# EAGLE schematic iot (EAGLE 6.5.0)
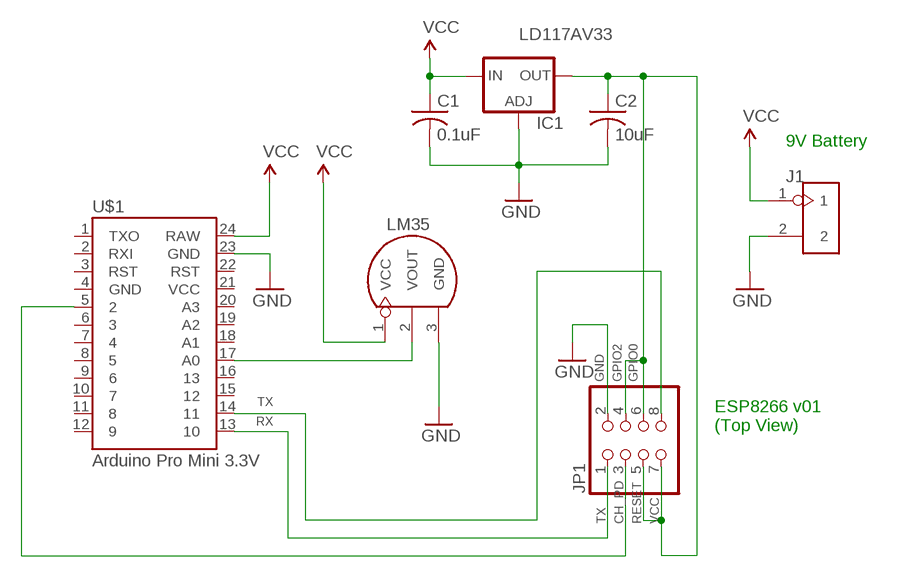
[diagram p0: schematic, sheet 1]

## Parts
C1  0.1uF  C-US025-024X044  [C025-024X044]
C2  10uF  C-US025-024X044  [C025-024X044]
IC1  LD117AV33  [TO220L1]
J1  HEADER-2P-1.5  [2P-1.5]
JP1  PINHD-2X4  [2X04]
LM35  SENSOR-LM35  [TO-92]
U$1  Arduino Pro Mini 3.3V  ARDUINO_MINI  [ARDUINO_MINI]

## Nets
GND: C1.2 C2.2 IC1.1(ADJ) J1.2 JP1.2 LM35.3(GND) U$1.23(GND)
N$1: LM35.2(VOUT) U$1.17(A0)
N$3: JP1.3 U$1.5
N$4: JP1.1 U$1.13
N$5: JP1.8 U$1.14
N$8: C2.1 IC1.2(OUT) JP1.4 JP1.5 JP1.6 JP1.7
VCC: C1.1 IC1.3(IN) J1.1 LM35.1(VCC) U$1.24(RAW)
Unconnected: U$1.1(TXO) U$1.2(RXI) U$1.3(RST) U$1.4(GND) U$1.6 U$1.7 U$1.8 U$1.9 U$1.10 U$1.11 U$1.12 U$1.15 U$1.16 U$1.18(A1) U$1.19(A2) U$1.20(A3) U$1.21(VCC) U$1.22(RST)

## Notes on the sheet
- 9V Battery
- GND | GPIO2 | GPIO0
- TX
- RX
- ESP8266 v01
  (Top View)
- TX | CH_PD | RESET | VCC

## Library data of the parts
C1 C2 = adafruit:C-US: CAPACITOR, American symbol
IC1 = v-reg:LD117A?*: Low drop fixed and adjustable positive voltage regulators 1 A Source: http://www.st.com/stonline/products/literature/ds/7194/ld1117axx.pdf
J1 = SeeedStudio-Connector:HEADER-2P
JP1 = adafruit:PINHD-2X4: PIN HEADER
LM35 = SeeedStudio-Discrete:SENSOR-LM35: Temperature Sensor http://search.digikey.com/scripts/DkSearch/dksus.dll?Detail&name=LM35DZ-ND
U$1 = SparkFun-Boards:ARDUINO_MINI: Arduino Pro Mini footprint